# Altium schematic sheet Gauges.SchDoc
size Letter; SheetNumber: 2; SheetTotal: 5
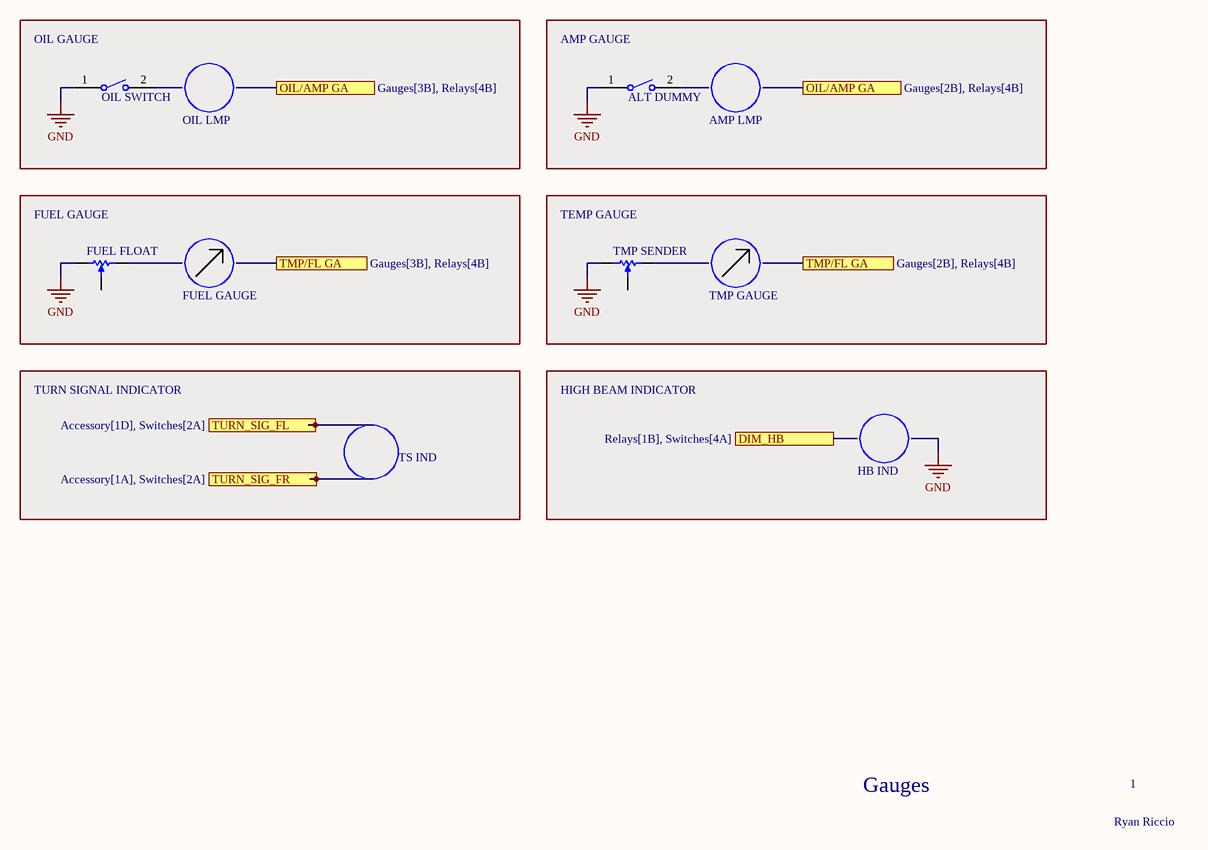
[diagram p0: Gauges.SchDoc]

## Parts
(Parts that share a designator on the sheet are numbered #1, #2 ... from top to bottom, then left to right.)
FUEL_FLOAT  3296W-1-102LF  [BOUR-3296W-1-3]  (value not drawn)
SW?#1  OIL SWITCH  [OMRON-B3U-3000P_V]
SW?#2  ALT DUMMY  [OMRON-B3U-3000P_V]
TMP_SENDER  3296W-1-102LF  [BOUR-3296W-1-3]  (value not drawn)

## Ports
DIM_HB (see Relays[1B], Switches[4A]), OIL/AMP GA (see Gauges[2B], Relays[4B]), OIL/AMP GA (see Gauges[3B], Relays[4B]), TMP/FL GA (see Gauges[2B], Relays[4B]), TMP/FL GA (see Gauges[3B], Relays[4B]), TURN_SIG_FL (see Accessory[1D], Switches[2A]), TURN_SIG_FR (see Accessory[1A], Switches[2A])

## Nets
GND: FUEL_FLOAT.1(A) SW?#1.1 SW?#2.1 TMP_SENDER.1(A)

Not connected (* = marked no-connect by the designer): FUEL_FLOAT 2(B) 3(TAP); SW?#1 2; SW?#2 2; TMP_SENDER 2(B) 3(TAP)

## Notes on the sheet
- (near SW?#1) OIL GAUGE
- (near SW?#2) AMP GAUGE
- OIL LMP
- AMP LMP
- (near FUEL_FLOAT) FUEL GAUGE
- (near TMP_SENDER) TEMP GAUGE
- FUEL GAUGE
- TMP GAUGE
- TURN SIGNAL INDICATOR
- HIGH BEAM INDICATOR
- TS IND
- HB IND
- Gauges
- 1
- Ryan Riccio

## Library data of the parts
FUEL_FLOAT TMP_SENDER = CMP-009-00037-2: Square Trimpot(R) Trimming Potentiometer, 1000 Ohm, -55 to 125 degC, 3-Pin THD, RoHS, Tube; Manufacturer: Bourns; Power: 500mW; Tolerance: 10%; Voltage Rating: 300V; Resistance: 1k; Datasheet Version: May-16; Min Operating Temperature: -55°C; Max Operating Temperature: 150°C; Composition: Potentiometer; Package Description: 3-Pin Through Hole Device, Body 9.53 x 4.83 mm, Pitch 2.54 mm; Manufacturer URL: http://www.bourns.com/; Package Reference: 3296W-1-3; RoHS Compliant: True; Case/Package: 3296W-1-3; Packaging: Rail/Tube; Mounting Technology: TH; Package Quantity: 50; Datasheet URL: http://www.bourns.com/docs/Product-Datasheets/3296.pdf
SW?#1 SW?#2 = CMP-011-00005-2: Tactile Switch, SPST-NO, 0.05 A, 12 V, -25 to 70 degC, 2-Pin SMD, RoHS, Tape and Reel; Manufacturer: Omron Electronic Components; Operating Force: 162gf; Voltage Rating (DC): 12V; Current Rating: 50mA; IP Rating: IP40; Throw Configuration: SPST; Max Contact Resistance: 100mohm; RoHS Compliant: True; Contact Current Rating: 50mA; Manufacturer URL: http://www.omron.com/; Packaging: TapeandReel; Max Voltage Rating (DC): 12V; Contact Material: Silver; Datasheet Version: Jan-15; Package Reference: B3U-3000P; Package Description: 2-Pin Surface Mount Device, Body 4 x 3.2 mm; Min Operating Temperature: -25°C; Package Quantity: 4000; Max Operating Temperature: 70°C; Max Current Rating: 50mA; Voltage Rating: 12V; Case/Package: B3U-3000P; Mounting Technology: SM; Datasheet URL: https://www.omron.com/ecb/products/pdf/en-b3u.pdf